# EAGLE design Launch_Tower_Power_Interface_Board_v1-1 (EAGLE 6.2)
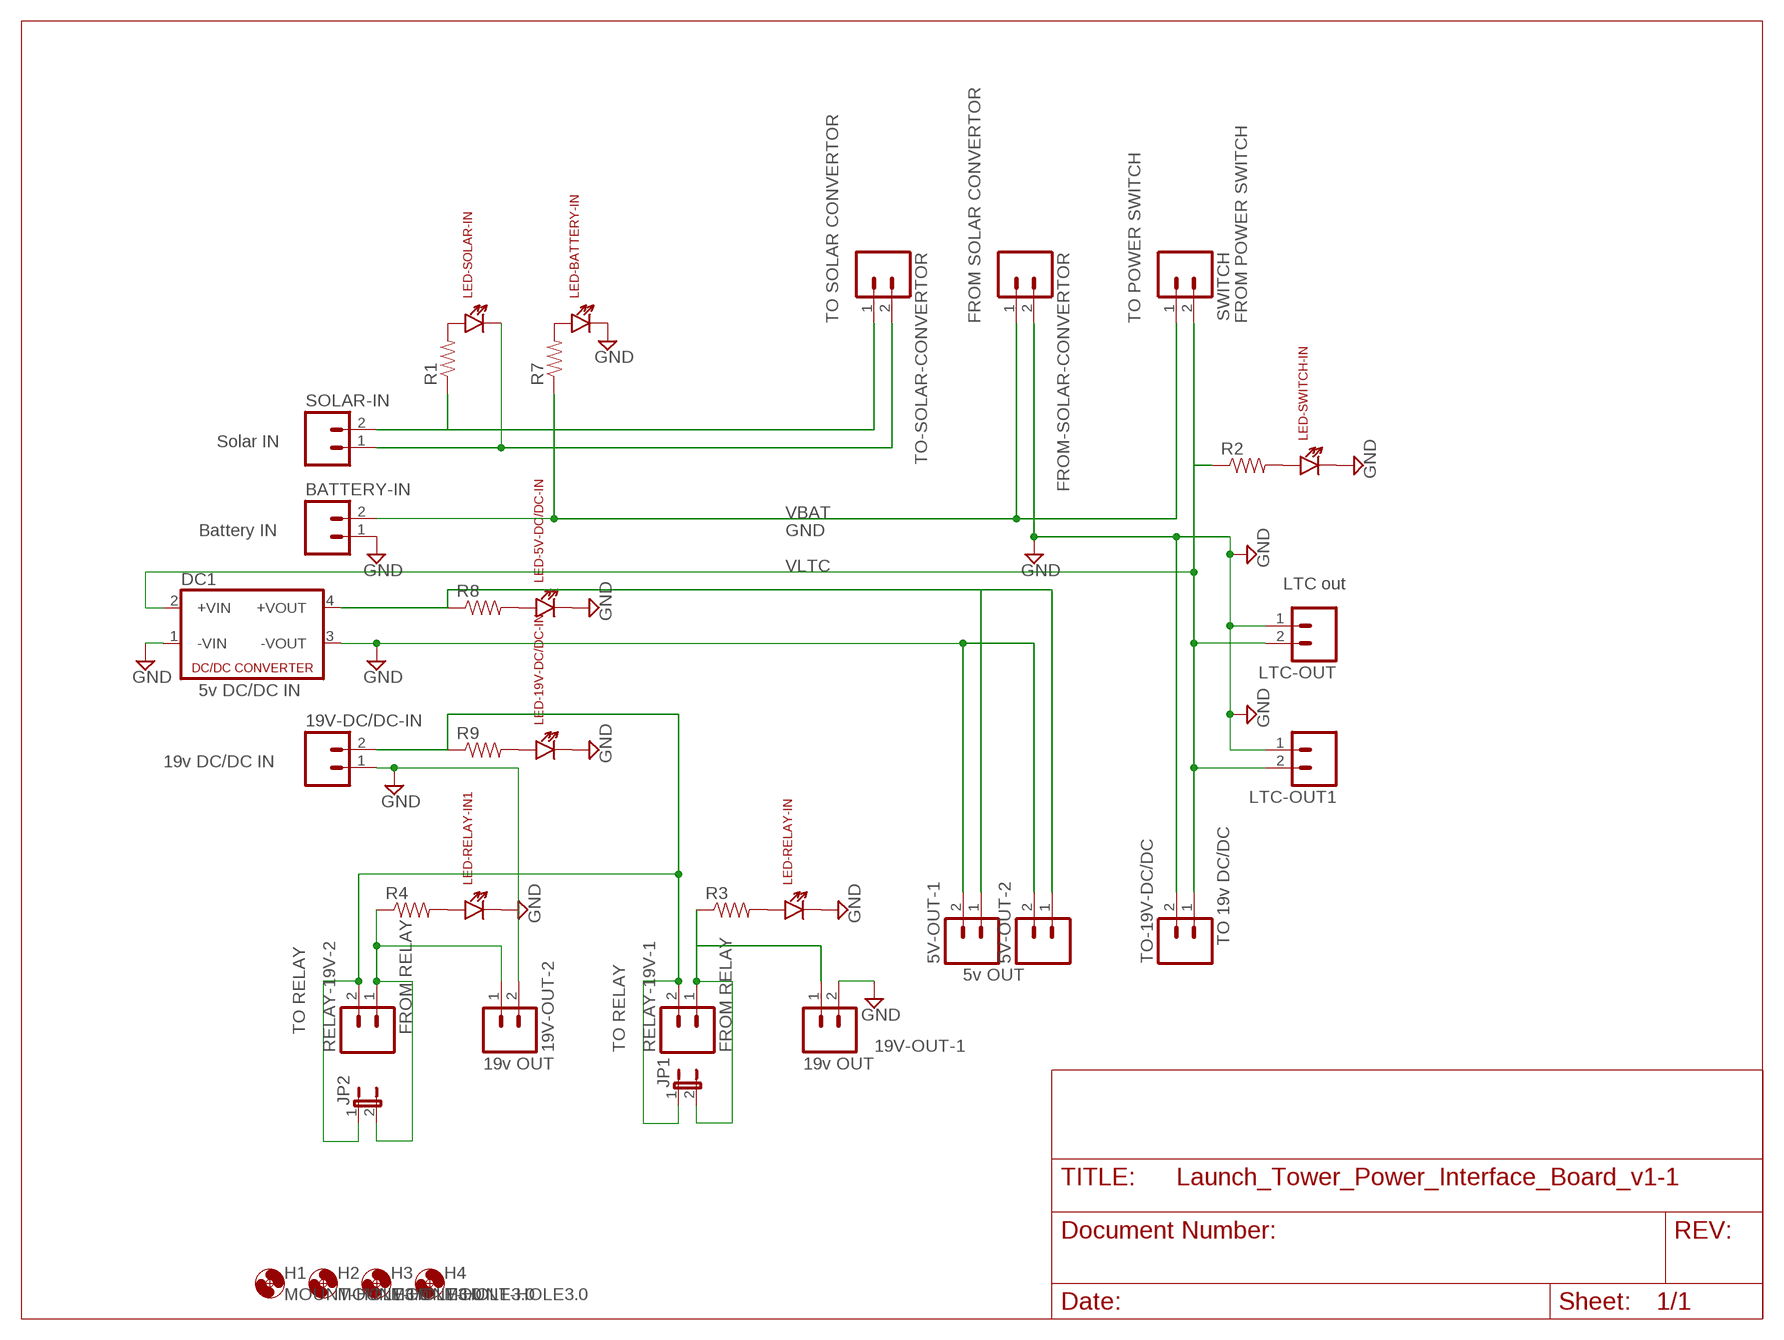
[diagram p0: schematic, sheet 1]

## Parts
5V-OUT-1  M023.5MM  [SCREWTERMINAL-3.5MM-2]
5V-OUT-2  M023.5MM  [SCREWTERMINAL-3.5MM-2]
19V-DC/DC-IN  M025MM  [SCREWTERMINAL-5MM-2]
19V-OUT-1  M025MM  [SCREWTERMINAL-5MM-2]
19V-OUT-2  M025MM  [SCREWTERMINAL-5MM-2]
BATTERY-IN  M025MM  [SCREWTERMINAL-5MM-2]
DC1  NME  [NME]
FROM-SOLAR-CONVERTOR  M025MM  [SCREWTERMINAL-5MM-2]
H1  MOUNT-HOLE3.0  [3,0]
H2  MOUNT-HOLE3.0  [3,0]
H3  MOUNT-HOLE3.0  [3,0]
H4  MOUNT-HOLE3.0  [3,0]
JP1  JUMPER-2PTH  [1X02]
JP2  JUMPER-2PTH  [1X02]
LED-5V-DC/DC-IN  LTE-302  [LTE-302]
LED-19V-DC/DC-IN  LTE-302  [LTE-302]
LED-BATTERY-IN  LTE-302  [LTE-302]
LED-RELAY-IN  LTE-302  [LTE-302]
LED-RELAY-IN1  LTE-302  [LTE-302]
LED-SOLAR-IN  LTE-302  [LTE-302]
LED-SWITCH-IN  LTE-302  [LTE-302]
LTC-OUT  M025MM  [SCREWTERMINAL-5MM-2]
LTC-OUT1  M025MM  [SCREWTERMINAL-5MM-2]
R1  RESISTORPTH-1/2W  [AXIAL-0.5]
R2  RESISTORPTH-1/2W  [AXIAL-0.5]
R3  RESISTORPTH-1/2W  [AXIAL-0.5]
R4  RESISTORPTH-1/2W  [AXIAL-0.5]
R7  RESISTORPTH-1/2W  [AXIAL-0.5]
R8  RESISTORPTH-1/2W  [AXIAL-0.5]
R9  RESISTORPTH-1/2W  [AXIAL-0.5]
RELAY-19V-1  M025MM  [SCREWTERMINAL-5MM-2]
RELAY-19V-2  M025MM  [SCREWTERMINAL-5MM-2]
SOLAR-IN  M025MM  [SCREWTERMINAL-5MM-2]
SWITCH  M025MM  [SCREWTERMINAL-5MM-2]
TO-19V-DC/DC  M025MM  [SCREWTERMINAL-5MM-2]
TO-SOLAR-CONVERTOR  M025MM  [SCREWTERMINAL-5MM-2]

## Nets
GND: 5V-OUT-1.2 5V-OUT-2.2 19V-DC/DC-IN.1 19V-OUT-1.2 19V-OUT-2.2 BATTERY-IN.1 DC1.1(-VIN) DC1.3(-VOUT) FROM-SOLAR-CONVERTOR.2 LED-5V-DC/DC-IN.C LED-19V-DC/DC-IN.C LED-BATTERY-IN.C LED-RELAY-IN1.C LED-RELAY-IN.C LED-SWITCH-IN.C LTC-OUT1.1 LTC-OUT.1 TO-19V-DC/DC.2
N$1: LED-SOLAR-IN.A R1.P$2
N$3: 19V-OUT-2.1 JP2.2 R4.P$1 RELAY-19V-2.1
N$4: 19V-OUT-1.1 JP1.2 R3.P$1 RELAY-19V-1.1
N$5: LED-SWITCH-IN.A R2.P$2
N$6: LED-RELAY-IN.A R3.P$2
N$8: LED-BATTERY-IN.A R7.P$2
N$9: LED-5V-DC/DC-IN.A R8.P$2
N$10: LED-RELAY-IN1.A R4.P$2
N$11: LED-19V-DC/DC-IN.A R9.P$2
N$12: LED-SOLAR-IN.C SOLAR-IN.1 TO-SOLAR-CONVERTOR.2
N$13: 19V-DC/DC-IN.2 JP1.1 JP2.1 R9.P$1 RELAY-19V-1.2 RELAY-19V-2.2
N$15: R1.P$1 SOLAR-IN.2 TO-SOLAR-CONVERTOR.1
N$17: 5V-OUT-1.1 5V-OUT-2.1 DC1.4(+VOUT) R8.P$1
VBAT: BATTERY-IN.2 FROM-SOLAR-CONVERTOR.1 R7.P$1 SWITCH.1
VLTC: DC1.2(+VIN) LTC-OUT1.2 LTC-OUT.2 R2.P$1 SWITCH.2 TO-19V-DC/DC.1

## Notes on the sheet
- TO SOLAR CONVERTOR | FROM SOLAR CONVERTOR | TO POWER SWITCH | FROM POWER SWITCH
- Solar IN
- Battery IN
- LTC out
- 5v DC/DC IN
- 19v DC/DC IN
- TO 19v DC/DC
- 5v OUT
- TO RELAY | FROM RELAY
- TO RELAY | FROM RELAY
- 19v OUT | 19v OUT

## Library data of the parts
5V-OUT-1 5V-OUT-2 19V-DC/DC-IN 19V-OUT-1 19V-OUT-2 BATTERY-IN FROM-SOLAR-CONVERTOR LTC-OUT LTC-OUT1 RELAY-19V-1 RELAY-19V-2 SOLAR-IN SWITCH TO-19V-DC/DC TO-SOLAR-CONVERTOR = SparkFun:M02: Header 2 Standard 2-pin 0.1" header. Use with straight break away headers (SKU : PRT-00116), right angle break away headers (PRT-00553), swiss pins (PRT-00743), machine pins (PRT-00117), and female headers (PRT-00115). Molex polarized connector foot print use with SKU : PRT-08233 with associated crimp pins and housings.
DC1 = dc-dc-converter:NME: DC-DC CONVERTER; MF: C & D TECHNOLOGIES, INC; MPN: NME1205D; OC_FARNELL: 1021466; OC_NEWARK: 98B8198
H1-H4 = holes:MOUNT-HOLE: MOUNTING HOLE with drill center marker
JP1 JP2 = SparkFun:JUMPER-2: Jumper Basic 0.1" spaced jumper. Use with breakaway headers.
LED-5V-DC/DC-IN LED-19V-DC/DC-IN LED-BATTERY-IN LED-RELAY-IN LED-RELAY-IN1 LED-SOLAR-IN LED-SWITCH-IN = SparkFun-LED:LTE-302: Through-hole side-firing 940nm IR LED
R1-R4 R7-R9 = SparkFun-Passives:RESISTOR: Resistor Basic schematic elements and footprints for 0603, 1206, and PTH resistors.

## Board
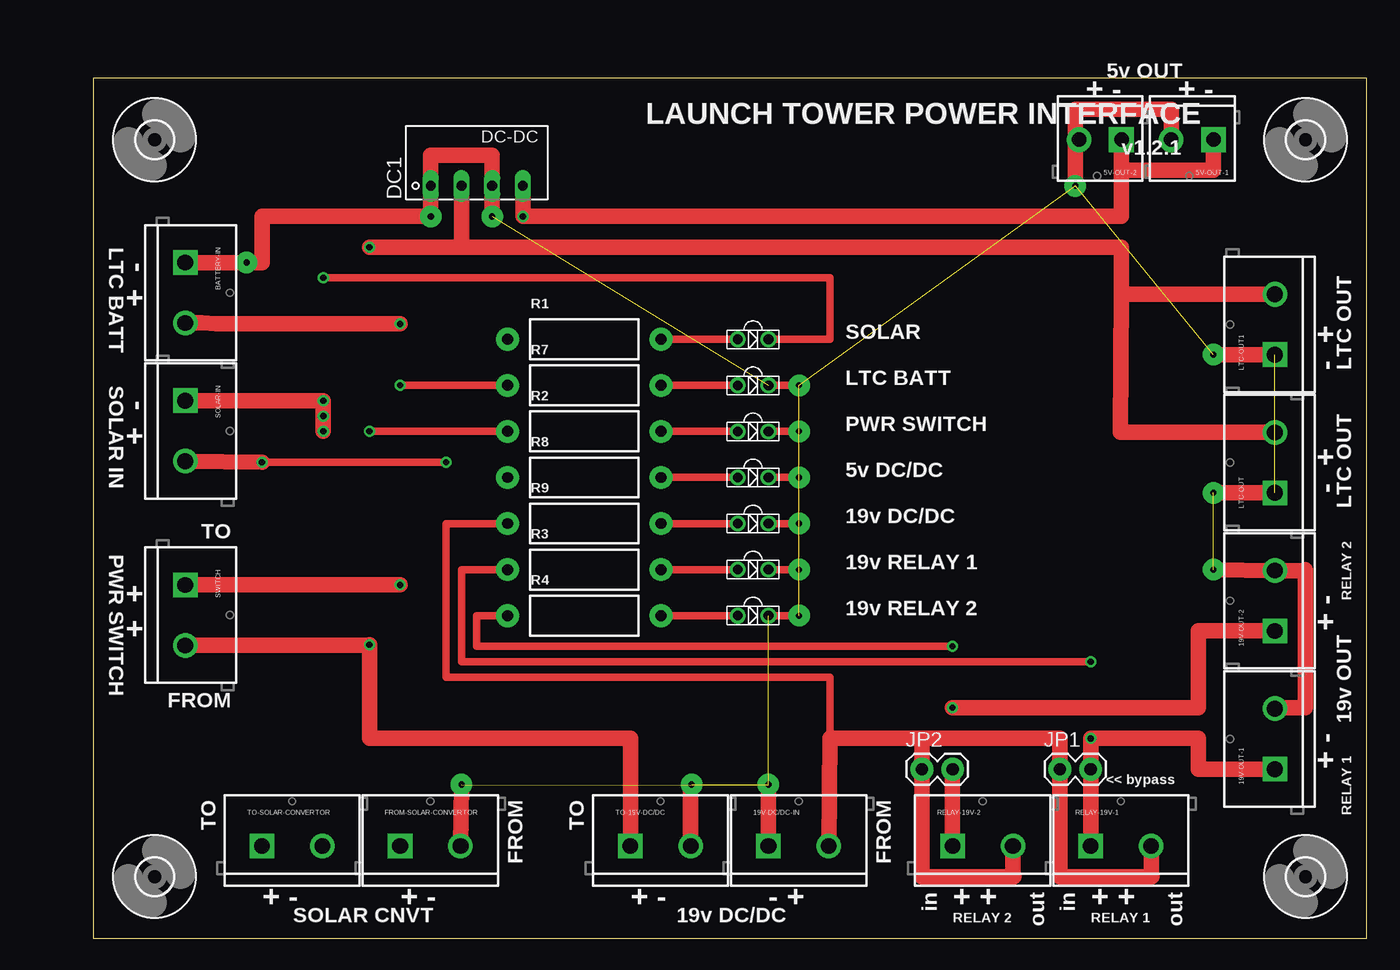
[diagram p1: board, top side]
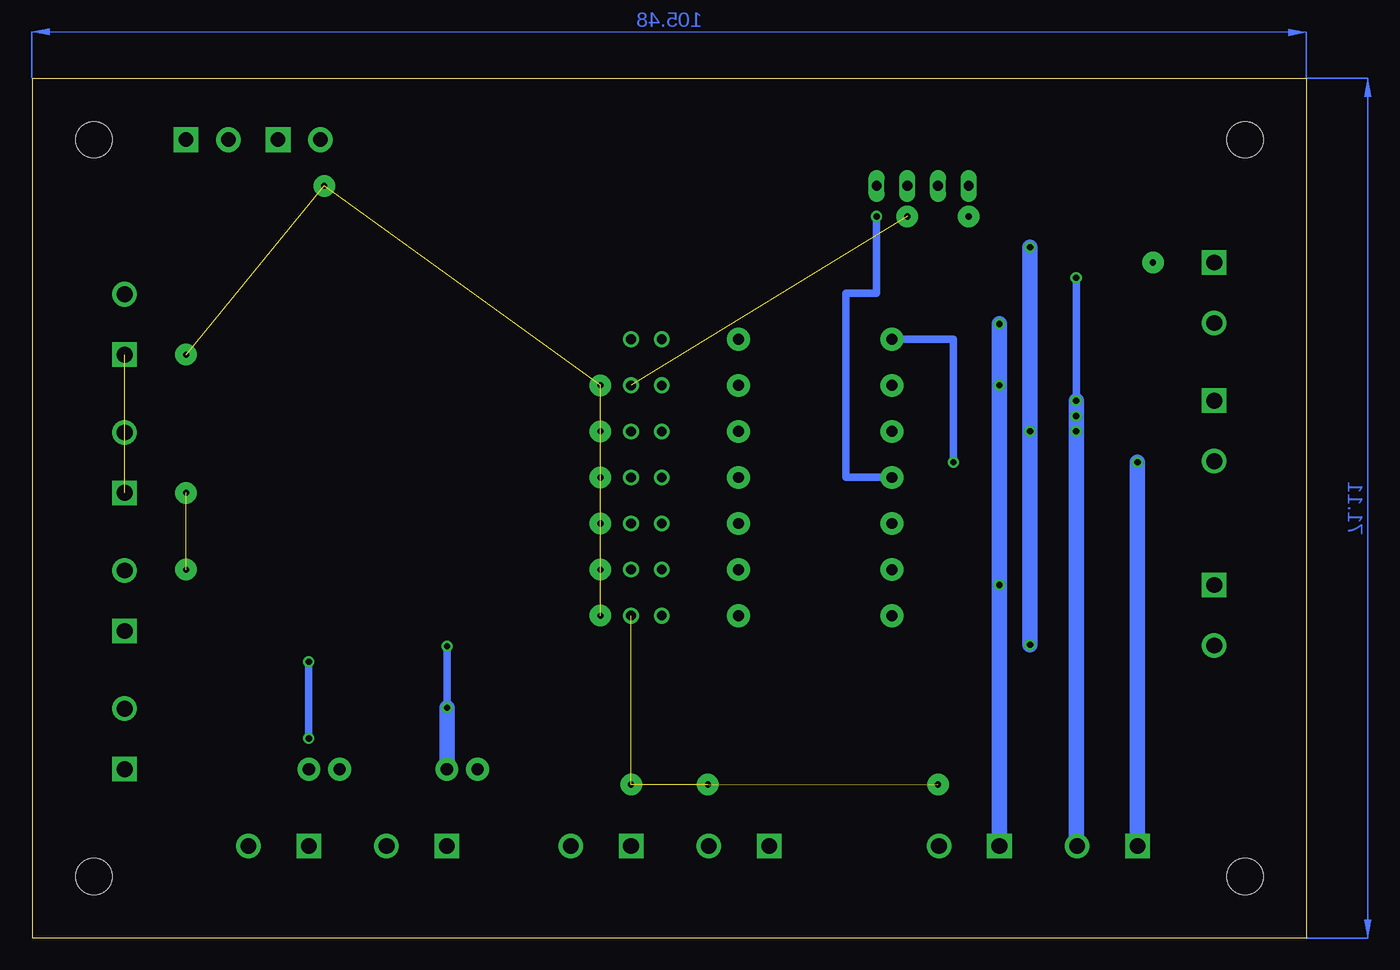
[diagram p2: board, bottom side, seen from below]

Size 105.41 x 71.12 mm. Coordinates in mm from the lower left corner, seen from the top.
Outline: 0,0 105.41,0 105.41,71.12 0,71.11 0,0
Copper layers (1*16): Top 0.035mm / dielectric 1.5mm / Bottom 0.035mm
Design rules: minimum track width 10mil, minimum drill 24mil, track to track 8mil, track to pad 8mil, pad to pad 8mil, via to via 8mil, smd to smd 8mil, copper to edge 40mil, drill to drill 8mil, minimum pad ring 10mil, minimum via ring 8mil, stop-mask expansion 4mil, vias tented up to drill 0mil, thermal gap 10mil

### Footprints (pad centres in the part's own frame; a part is rotated, then mirrored left to right if it is on the bottom)
SCREWTERMINAL-3.5MM-2 = drill 1.2 pad 2.032 square: 1 0,0 | drill 1.2 pad 2.032: 2 3.5,0
SCREWTERMINAL-5MM-2 = drill 1.3 pad 2.032 square: 1 0,0 | drill 1.3 pad 2.032: 2 5,0
NME = drill 0.813 long: 1 0,3.81; 2 0,1.27; 3 0,-1.27; 4 0,-3.81
3,0 = hole 3: 0,0
1X02 = drill 1.016 pad 1.88: 1 0,0; 2 2.54,0
LTE-302 = drill 0.8: A 1.27,0; C -1.27,0
AXIAL-0.5 = drill 0.9 pad 1.88: P$1 -6.35,0; P$2 6.35,0

### Placement (x,y rotation side)
5V-OUT-1  92.71,66.04 180 top
5V-OUT-2  85.09,66.04 180 top
19V-DC/DC-IN  55.88,7.62 0 top
19V-OUT-1  97.79,13.97 90 top
19V-OUT-2  97.79,25.4 90 top
BATTERY-IN  7.62,55.88 270 top
DC1  31.75,62.23 90 top
FROM-SOLAR-CONVERTOR  25.4,7.62 0 top
H1  5.08,66.04 0 top
H2  5.08,5.08 0 top
H3  100.33,5.08 0 top
H4  100.33,66.04 0 top
JP1  80.01,13.97 0 top
JP2  68.58,13.97 0 top
LED-5V-DC/DC-IN  54.61,38.1 180 top
LED-19V-DC/DC-IN  54.61,34.29 180 top
LED-BATTERY-IN  54.61,45.72 180 top
LED-RELAY-IN  54.61,30.48 180 top
LED-RELAY-IN1  54.61,26.67 180 top
LED-SOLAR-IN  54.61,49.53 180 top
LED-SWITCH-IN  54.61,41.91 180 top
LTC-OUT  97.79,36.83 90 top
LTC-OUT1  97.79,48.26 90 top
R1  40.64,49.53 0 top
R2  40.64,41.91 0 top
R3  40.64,30.48 0 top
R4  40.64,26.67 0 top
R7  40.64,45.72 0 top
R8  40.64,38.1 0 top
R9  40.64,34.29 0 top
RELAY-19V-1  82.55,7.62 0 top
RELAY-19V-2  71.12,7.62 0 top
SOLAR-IN  7.62,44.45 270 top
SWITCH  7.62,29.21 270 top
TO-19V-DC/DC  44.45,7.62 0 top
TO-SOLAR-CONVERTOR  13.97,7.62 0 top

### Tracks (layer width: path | path; a pad name or v marks a point on that pad's centre or on a via)
GND  (via drill 0.51 pad 1.78)  (13 unrouted)
  Top 0.61: LED-BATTERY-IN.C v58.42,45.72 | v58.42,41.91 LED-SWITCH-IN.C | v58.42,38.1 LED-5V-DC/DC-IN.C | v58.42,34.29 LED-19V-DC/DC-IN.C | v58.42,30.48 LED-RELAY-IN.C | v58.42,26.67 LED-RELAY-IN1.C
  Top 1.27: 5V-OUT-1.2 89.21,68.58 81.28,68.58 81.28,66.04 | 81.28,66.04 5V-OUT-2.2 | 81.28,66.04 v81.28,62.23 | LTC-OUT.1 v92.71,36.83 | v92.71,30.48 19V-OUT-2.2 100.25,30.4 100.33,30.48 100.33,19.05 97.87,19.05 19V-OUT-1.2 | BATTERY-IN.1 v12.7,55.88 13.97,55.88 13.97,59.69 v27.94,59.69 DC1.1 27.94,64.77 33.02,64.77 DC1.3 v33.02,59.69 | 19V-DC/DC-IN.1 v55.88,12.7 | FROM-SOLAR-CONVERTOR.2 v30.48,12.7 | TO-19V-DC/DC.2 49.45,12.62 v49.53,12.7 | LTC-OUT1.1 v92.71,48.26
N$1
  Top 0.61: LED-SOLAR-IN.A R1.P$2
N$3  (via drill 0.51)
  Top 0.61: R4.P$1 31.75,26.67 31.75,24.13 v71.12,24.13
  Top 1.27: RELAY-19V-2.1 JP2.2 | v71.12,19.05 91.44,19.05 91.44,25.4 19V-OUT-2.1
  Bottom 0.61: v71.12,24.13 v71.12,19.05
  Bottom 1.27: JP2.2 v71.12,19.05
N$4  (via drill 0.51)
  Top 0.61: R3.P$1 30.48,30.48 30.48,22.86 v82.55,22.86
  Top 1.27: 19V-OUT-1.1 91.44,13.97 91.44,16.51 v82.55,16.51 JP1.2 RELAY-19V-1.1
  Bottom 0.61: v82.55,22.86 v82.55,16.51
N$5
  Top 0.61: R2.P$2 LED-SWITCH-IN.A
N$6
  Top 0.61: LED-RELAY-IN.A R3.P$2
N$8
  Top 0.61: R7.P$2 LED-BATTERY-IN.A
N$9
  Top 0.61: LED-5V-DC/DC-IN.A R8.P$2
N$10
  Top 0.61: LED-RELAY-IN1.A R4.P$2
N$11
  Top 0.61: R9.P$2 LED-19V-DC/DC-IN.A
N$12  (via drill 0.51, 0.51 pad 0.61)
  Top 0.61: v19.05,54.61 60.96,54.61 60.96,49.53 LED-SOLAR-IN.C
  Top 1.27: SOLAR-IN.1 v19.05,44.45 v19.05,41.91
  Bottom 0.254: 19.05,7.7 TO-SOLAR-CONVERTOR.2
  Bottom 0.61: v19.05,44.45 v19.05,54.61
  Bottom 1.27: 19.05,7.7 v19.05,44.45
  other vias: 19.05,43.18
N$13
  Top 0.61: 60.96,16.51 60.96,21.59 29.21,21.59 29.21,34.29 R9.P$1 | 87.55,5.16 87.63,5.08
  Top 1.27: 19V-DC/DC-IN.2 60.96,16.51 68.58,16.51 | RELAY-19V-1.2 87.55,5.16 | 87.63,5.08 80.01,5.08 JP1.1 80.01,16.51 68.58,16.51 | 68.58,16.51 JP2.1 68.58,5.08 76.2,5.08 76.12,5.16 RELAY-19V-2.2
N$15  (via drill 0.51)
  Top 0.61: v13.97,39.37 v29.21,39.37
  Top 1.27: SOLAR-IN.2 v13.97,39.37
  Bottom 0.61: v29.21,39.37 29.21,49.53 R1.P$1
  Bottom 1.27: v13.97,39.37 TO-SOLAR-CONVERTOR.1
N$17  (via drill 0.51)
  Top 1.27: 5V-OUT-1.1 92.71,63.5 85.09,63.5 | 85.09,63.5 5V-OUT-2.1 | 85.09,63.5 85.09,59.69 v35.56,59.69 DC1.4
  Bottom 0.61: R8.P$1 38.1,38.1 38.1,53.34 35.56,53.34 v35.56,59.69
VBAT  (via drill 0.51)
  Top 0.61: R7.P$1 v25.4,45.72
  Top 1.27: BATTERY-IN.2 8.97,50.88 10.16,50.8 v25.4,50.8 | SWITCH.1 v25.4,29.21
  Bottom 1.27: FROM-SOLAR-CONVERTOR.1 v25.4,29.21 v25.4,45.72 v25.4,50.8
VLTC  (via drill 0.51)
  Top 0.61: R2.P$1 v22.86,41.91
  Top 1.27: TO-19V-DC/DC.1 44.45,16.51 22.86,16.51 v22.86,24.26 22.81,24.21 SWITCH.2 | LTC-OUT.2 85.01,41.83 85.07,53.34 | 85.07,53.34 85.09,57.15 30.48,57.15 | 30.48,57.15 v22.86,57.15 | DC1.2 30.48,57.15 | LTC-OUT1.2 85.15,53.26 85.07,53.34
  Bottom 1.27: v22.86,57.15 v22.86,41.91 v22.86,24.26
(copper drawn outside any net)
  shapes: Bottom area x2

### Text on the board
tPlace: 5v OUT | + - | + - | LAUNCH TOWER POWER INTERFACE | v1.2.1 | LTC BATT | + - | SOLAR | - + | LTC OUT | SOLAR IN | LTC BATT | + - | PWR SWITCH | 5v DC/DC | - + | LTC OUT | TO | 19v DC/DC | PWR SWITCH | 19v RELAY 1 | + + | RELAY 2 | 19v RELAY 2 | + - | FROM | 19v OUT | + - | << bypass | TO | FROM | TO | FROM | RELAY 1 | in | out | in | out | + - | + - | + - | - + | + + | + + | SOLAR CNVT | 19v DC/DC | RELAY 2 | RELAY 1